# Altium project PCB_BoardAT2560.PrjPCB
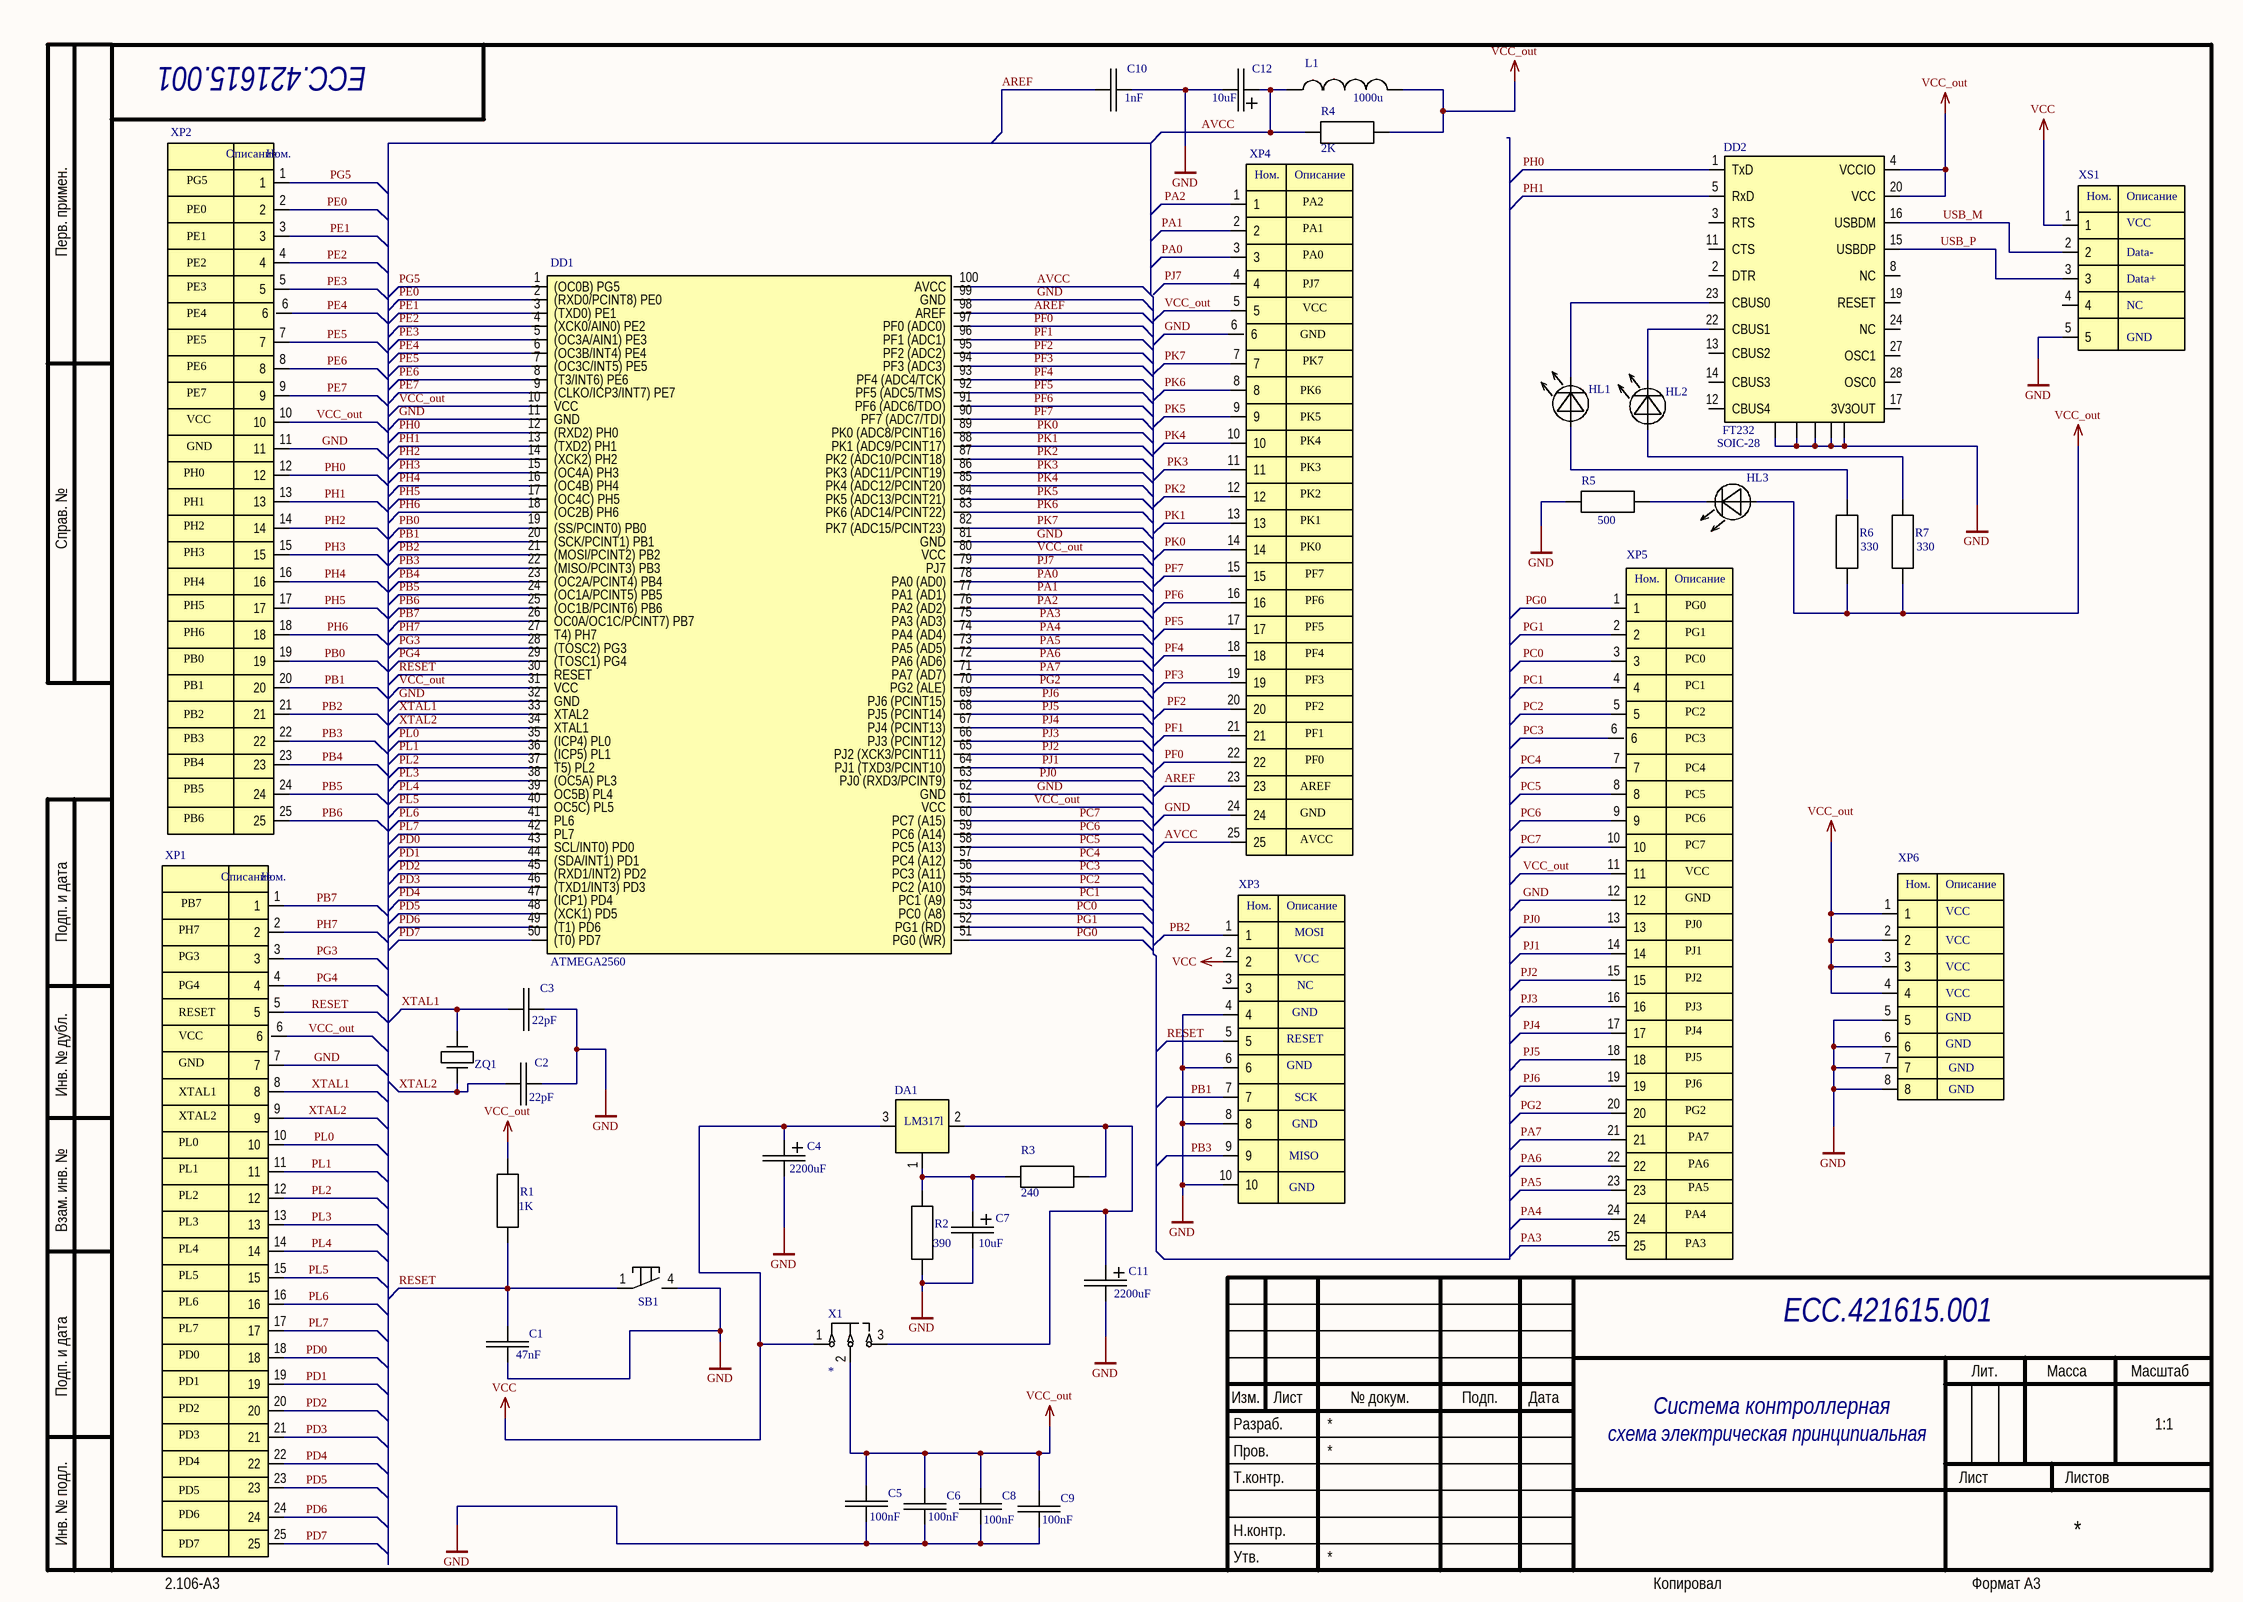
[diagram p0: AT2560circuit.SchDoc]
1 sheet, 36 parts. Net scope: global (net labels, ports and power ports of the same name join across sheets).
Board files: PCBAT2560ver1.PcbDoc, PCBPannel.PcbDoc

## Sheet AT2560circuit.SchDoc
size 420 x 297 mm; Scale: 1:1

### Parts
C1  Номинал: 47nF  [CAPC2012L]  (hidden comment: Capasitor)
C2  Номинал: 22pF  [CAPC2012L]  (hidden comment: Capasitor)
C3  Номинал: 22pF  [CAPC2012L]  (hidden comment: Capasitor)
C4  Номинал: 2200uF  [K50-Elect]  (hidden comment: Electrolit_capasitor)
C5  Номинал: 100nF  [CAPC2012L]  (hidden comment: Capasitor)
C6  Номинал: 100nF  [CAPC2012L]  (hidden comment: Capasitor)
C7  Номинал: 10uF  [K50-Elect]  (hidden comment: Electrolit_capasitor)
C8  Номинал: 100nF  [CAPC2012L]  (hidden comment: Capasitor)
C9  Номинал: 100nF  [CAPC2012L]  (hidden comment: Capasitor)
C10  Номинал: 1nF  [CAPC2012L]  (hidden comment: Capasitor)
C11  Номинал: 2200uF  [K50-Elect]  (hidden comment: Electrolit_capasitor)
C12  Номинал: 10uF  [K50-Elect]  (hidden comment: Electrolit_capasitor)
DA1  LM317l  [TO-263-3]  (value not drawn)
DD1  ATMega2560  [TSQFP50P1600X1600X120-100N]
DD2  Корпус: SOIC-28  [SSOP-28]  (hidden comment: FT232)
HL1  LED  [LED]  (value not drawn)
HL2  LED  [LED]  (value not drawn)
HL3  LED  [LED]  (value not drawn)
L1  Номинал: 1000u  [Drossel]  (hidden comment: Inductor)
R1  Номинал: 1K  [RESC2012L]  (hidden comment: Resistor)
R2  Номинал: 390  [RESC2012L]  (hidden comment: Resistor)
R3  Номинал: 240  [RESC2012L]  (hidden comment: Resistor)
R4  Номинал: 2K  [RESC2012L]  (hidden comment: Resistor)
R5  Номинал: 500  [RESC2012L]  (hidden comment: Resistor)
R6  Номинал: 330  [RESC2012L]  (hidden comment: Resistor)
R7  Номинал: 330  [RESC2012L]  (hidden comment: Resistor)
SB1  button  [KLS2]  (value not drawn)
X1  jumper  [PLSx3_XP]  (value not drawn)
XP1  Connector_plsx25  [PLSx25_XP]  (value not drawn)
XP2  Connector_plsx25  [PLSx25_XP]  (value not drawn)
XP3  pls-6  [PLS6-2]  (value not drawn)
XP4  Connector_plsx25  [PLSx25_XP]  (value not drawn)
XP5  Connector_plsx25  [PLSx25_XP]  (value not drawn)
XP6  Power_Connector  [PLS-8-2]  (value not drawn)
XS1  USB_mini_B  [KLS1-229-5FE]  (value not drawn)
ZQ1  Rezanator  [STS]  (value not drawn)

### Nets
GND: C1.2 C2.1 C3.1 C4.2 C5.2 C6.2 C7.2 C8.2 C9.2 C10.2 C11.2 C12.2 DD1.11(GND) DD1.32(GND) DD1.62(GND) DD1.81(GND) DD1.99(GND) DD2.7 DD2.18 DD2.21 DD2.25 DD2.26 R2.1 R5.1 SB1.4 XP1.7 XP2.11 XP3.4 XP3.6 XP3.8 XP3.10 XP4.6 XP4.24 XP5.12 XP6.5 XP6.6 XP6.7 XP6.8 XS1.5
VCC: C4.1 DA1.3 X1.1 XP3.2 XS1.1
VCC_out: C5.1 C6.1 C8.1 C9.1 DD1.10(VCC) DD1.31(VCC) DD1.61(VCC) DD1.80(VCC) DD2.4(VCCIO) DD2.20(VCC) HL3.1 L1.2 R1.2 R4.2 R6.1 R7.1 X1.2 XP1.6 XP2.10 XP4.5 XP5.11 XP6.1 XP6.2 XP6.3 XP6.4
AREF: C10.1 DD1.98(AREF) XP4.23
AVCC: C12.1 DD1.100(AVCC) L1.1 R4.1 XP4.25
PA0: DD1.78(PA0_(AD0)) XP4.3
PA1: DD1.77(PA1_(AD1)) XP4.2
PA2: DD1.76(PA2_(AD2)) XP4.1
PA3: DD1.75(PA3_(AD3)) XP5.25
PA4: DD1.74(PA4_(AD4)) XP5.24
PA5: DD1.73(PA5_(AD5)) XP5.23
PA6: DD1.72(PA6_(AD6)) XP5.22
PA7: DD1.71(PA7_(AD7)) XP5.21
PB0: DD1.19((SS/PCINT0)_PB0) XP2.19
PB1: DD1.20((SCK/PCINT1)_PB1) XP2.20 XP3.7
PB2: DD1.21((MOSI/PCINT2)_PB2) XP2.21 XP3.1
PB3: DD1.22((MISO/PCINT3)_PB3) XP2.22 XP3.9
PB4: DD1.23((OC2A/PCINT4)_PB4) XP2.23
PB5: DD1.24((OC1A/PCINT5)_PB5) XP2.24
PB6: DD1.25((OC1B/PCINT6)_PB6) XP2.25
PB7: DD1.26(OC0A/OC1C/PCINT7)_PB7) XP1.1
PC0: DD1.53(PC0_(A8)) XP5.3
PC1: DD1.54(PC1_(A9)) XP5.4
PC2: DD1.55(PC2_(A10)) XP5.5
PC3: DD1.56(PC3_(A11)) XP5.6
PC4: DD1.57(PC4_(A12)) XP5.7
PC5: DD1.58(PC5_(A13)) XP5.8
PC6: DD1.59(PC6_(A14)) XP5.9
PC7: DD1.60(PC7_(A15)) XP5.10
PD0: DD1.43(SCL/INT0)_PD0) XP1.18
PD1: DD1.44((SDA/INT1)_PD1) XP1.19
PD2: DD1.45((RXD1/INT2)_PD2) XP1.20
PD3: DD1.46((TXD1/INT3)_PD3) XP1.21
PD4: DD1.47((ICP1)_PD4) XP1.22
PD5: DD1.48((XCK1)_PD5) XP1.23
PD6: DD1.49((T1)_PD6) XP1.24
PD7: DD1.50((T0)_PD7) XP1.25
PE0: DD1.2((RXD0/PCINT8)_PE0) XP2.2
PE1: DD1.3((TXD0)_PE1) XP2.3
PE2: DD1.4((XCK0/AIN0)_PE2) XP2.4
PE3: DD1.5((OC3A/AIN1)_PE3) XP2.5
PE4: DD1.6((OC3B/INT4)_PE4) XP2.6
PE5: DD1.7((OC3C/INT5)_PE5) XP2.7
PE6: DD1.8((T3/INT6)_PE6) XP2.8
PE7: DD1.9((CLKO/ICP3/INT7)_PE7) XP2.9
PF0: DD1.97(PF0_(ADC0)) XP4.22
PF1: DD1.96(PF1_(ADC1)) XP4.21
PF2: DD1.95(PF2_(ADC2)) XP4.20
PF3: DD1.94(PF3_(ADC3)) XP4.19
PF4: DD1.93(PF4_(ADC4/TCK)) XP4.18
PF5: DD1.92(PF5_(ADC5/TMS)) XP4.17
PF6: DD1.91(PF6_(ADC6/TDO)) XP4.16
PF7: DD1.90(PF7_(ADC7/TDI)) XP4.15
PG0: DD1.51(PG0_(WR)) XP5.1
PG1: DD1.52(PG1_(RD)) XP5.2
PG2: DD1.70(PG2_(ALE)) XP5.20
PG3: DD1.28((TOSC2)_PG3) XP1.3
PG4: DD1.29((TOSC1)_PG4) XP1.4
PG5: DD1.1((OC0B)_PG5) XP2.1
PH0: DD1.12((RXD2)_PH0) DD2.1(TxD) XP2.12
PH1: DD1.13((TXD2)_PH1) DD2.5(RxD) XP2.13
PH2: DD1.14((XCK2)_PH2) XP2.14
PH3: DD1.15((OC4A)_PH3) XP2.15
PH4: DD1.16((OC4B)_PH4) XP2.16
PH5: DD1.17((OC4C)_PH5) XP2.17
PH6: DD1.18((OC2B)_PH6) XP2.18
PH7: DD1.27(T4)_PH7) XP1.2
PJ0: DD1.63(PJ0_(RXD3/PCINT9)) XP5.13
PJ1: DD1.64(PJ1_(TXD3/PCINT10)) XP5.14
PJ2: DD1.65(PJ2_(XCK3/PCINT11)) XP5.15
PJ3: DD1.66(PJ3_(PCINT12)) XP5.16
PJ4: DD1.67(PJ4_(PCINT13)) XP5.17
PJ5: DD1.68(PJ5_(PCINT14)) XP5.18
PJ6: DD1.69(PJ6_(PCINT15)) XP5.19
PJ7: DD1.79(PJ7) XP4.4
PK0: DD1.89(PK0_(ADC8/PCINT16)) XP4.14
PK1: DD1.88(PK1_(ADC9/PCINT17)) XP4.13
PK2: DD1.87(PK2_(ADC10/PCINT18)) XP4.12
PK3: DD1.86(PK3_(ADC11/PCINT19)) XP4.11
PK4: DD1.85(PK4_(ADC12/PCINT20)) XP4.10
PK5: DD1.84(PK5_(ADC13/PCINT21)) XP4.9
PK6: DD1.83(PK6_(ADC14/PCINT22)) XP4.8
PK7: DD1.82(PK7_(ADC15/PCINT23)) XP4.7
PL0: DD1.35((ICP4)_PL0) XP1.10
PL1: DD1.36((ICP5)_PL1) XP1.11
PL2: DD1.37(T5)_PL2) XP1.12
PL3: DD1.38((OC5A)_PL3) XP1.13
PL4: DD1.39(OC5B)_PL4) XP1.14
PL5: DD1.40(OC5C)_PL5) XP1.15
PL6: DD1.41(PL6) XP1.16
PL7: DD1.42(PL7) XP1.17
RESET: C1.1 DD1.30(RESET) R1.1 SB1.1 XP1.5 XP3.5
USB_M: DD2.16(USBDM) XS1.2
USB_P: DD2.15(USBDP) XS1.3
XTAL1: C3.2 DD1.33(XTAL2) XP1.8 ZQ1.2
XTAL2: C2.2 DD1.34(XTAL1) XP1.9 ZQ1.1
NetC7_1: C7.1 DA1.1 R2.2 R3.2
NetC11_1: C11.1 DA1.2 R3.1 X1.3
NetDD2_22: DD2.22(CBUS1) HL2.2
NetDD2_23: DD2.23(CBUS0) HL1.2
NetHL1_1: HL1.1 R6.2
NetHL2_1: HL2.1 R7.2
NetHL3_2: HL3.2 R5.2

Not connected (* = marked no-connect by the designer): DD2 2(DTR) 3(RTS) 8(NC) 11(CTS) 12(CBUS4) 13(CBUS2) 14(CBUS3) 17(3V3OUT) 19(RESET) 24(NC) 27(OSC1) 28(OSC0); XP3 3; XS1 4

### Notes on the sheet
- ЕСС.421615.001
- PG5
- PA2
- PE0
- PE1
- PE2
- PA0
- PA1
- PE3
- PE4
- PE5
- (near XP4) GND
- PJ7
- VCC
- PE6
- PE7
- (near XP4) PK6
- PK7
- PH0
- GND
- (near XP4) PK3
- (near XP4) PK4
- (near XP4) PK5
- PH1
- PH2
- (near XP4) PK1
- (near XP4) PK2
- PH3
- PH4
- PH5
- (near XP4) PK0
- PF6
- PF7
- PG0
- PH6
- PB0
- PF4
- PF5
- PG1
- PC0
- PB1
- PB2
- PB3
- PF1
- PF2
- PF3
- PC1
- PC2
- PC3
- PB4
- PB5
- (near XP4) AREF
- PF0
- PC4
- PC5
- PB6
- (near XP4) AVCC
- PC6
- PC7
- PH7
- PB7
- PJ0
- PG3
- PG4
- RESET
- PJ1
- PJ2
- PJ3
- PJ4
- PJ5
- XTAL1
- XTAL2
- PL0
- PJ6
- PG2
- PA7
- PL1
- PL2
- PA4
- PA5
- PA6
- PL3
- PL4
- PL5
- PA3
- PL6
- PL7
- PD0
- PD1
- PD2
- Система контроллерная
- PD3
- PD4
- схема электрическая принципиальная
- PD5
- PD6
- PD7
- Перв. примен.
- Справ. №
- Подп. и дата
- Инв. № дубл.
- Взам. инв. №
- Разраб.
- Изм.
- Лист
- № докум.
- Подп.
- Дата
- Лит.
- Масса
- Масштаб
- Пров.
- Т.контр.
- Листов
- Инв. № подл.
- Утв.
- Н.контр.
- 2.106-A3
- Копировал
- Формат А3
- (in symbol Connector_plsx25) Описание; Ном.
- (in symbol pls-6) Ном.; Описание; MOSI; VCC; NC; GND; RESET; SCK; MISO
- (in symbol Power_Connector) Ном.; Описание; VCC; GND
- (in symbol USB_mini_B) Ном.; Описание; VCC; Data-; Data+; NC; GND

### Library data of the parts
DA1 = LM317l: Корпус: TO-263; Марка: *; Производитель: *
DD1 = ATMega2560: Корпус: TQFP100; Марка: ATMEGA2560; Производитель: *
DD2 = FT232: Производитель: Texas Instruments; марка: FT232
C1-C3 C5 C6 C8-C10 = Capasitor: Марка: *; Производитель: *; Напряжение: *
C4 C7 C11 C12 = Electrolit_capasitor: Производитель: *; Напряжение: *
HL1-HL3 = LED: Марка: *; Производитель: *; Цвет: *
R1-R7 = Resistor: Марка: *; Производитель: *; Мощность: *
X1 = jumper: Производитель: *; марка: *
XP3 = pls-6: Марка: *; Производитель: *
XP6 = Power_Connector: Марка: *; производитель: *
XS1 = USB_mini_B: Марка: *; производитель: *